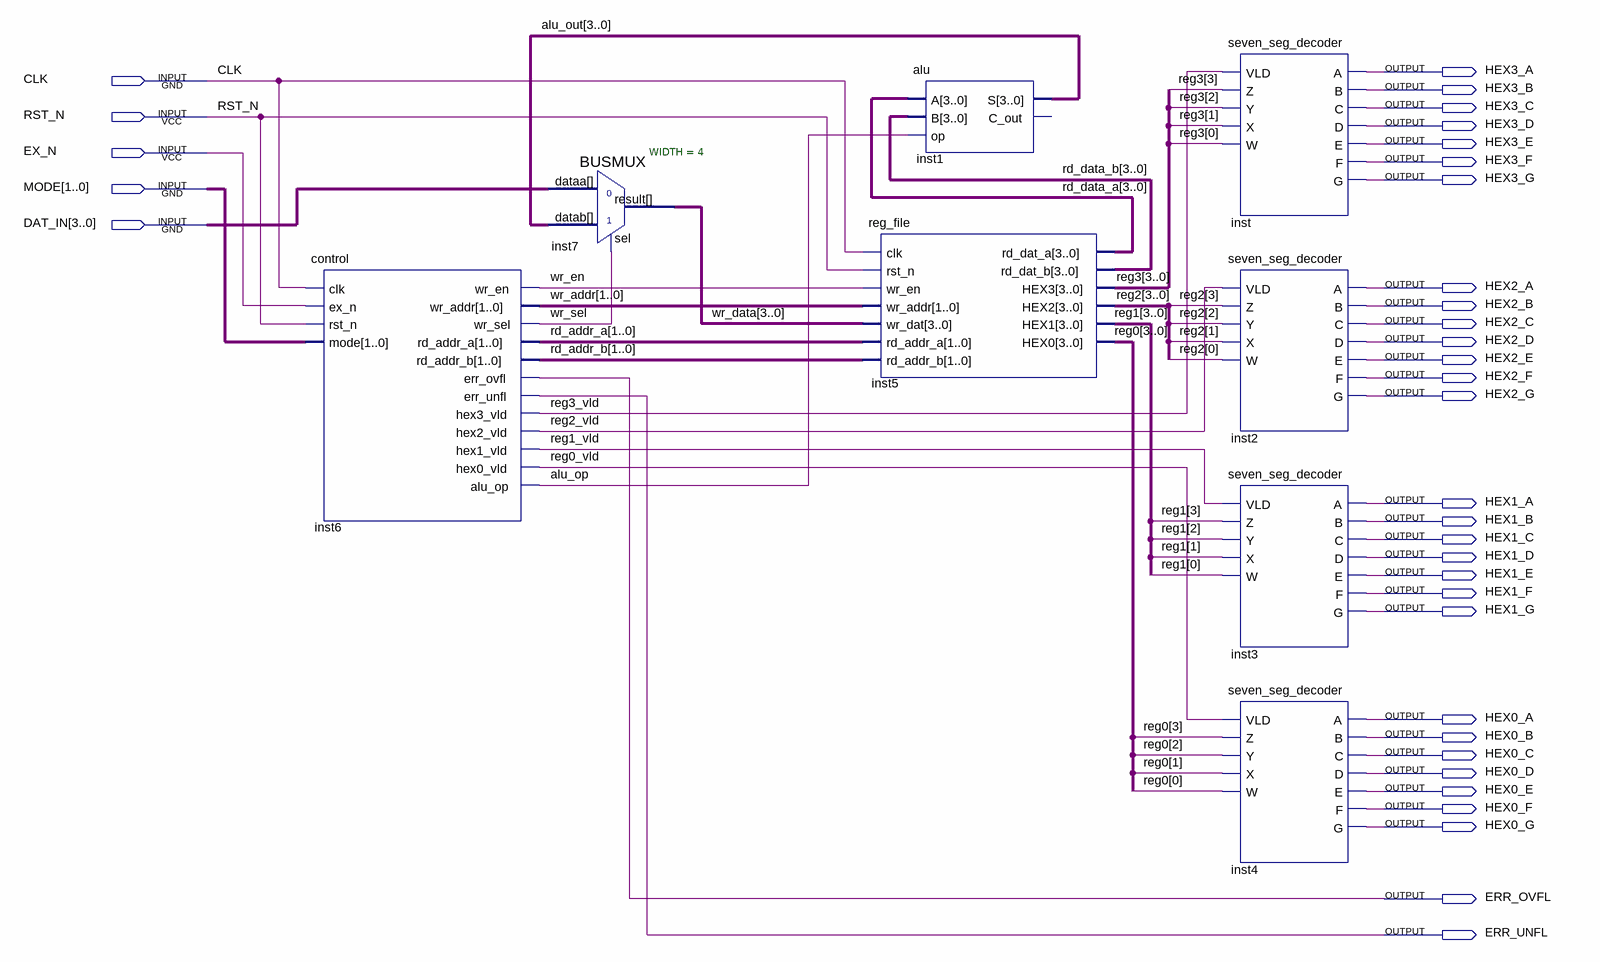
[diagram p0: schematic sheet]
// Quartus schematic final_proj.bdf as structural Verilog: 8 symbols, 35 pins
module final_proj (
  input  CLK,
  input  RST_N,
  input  EX_N,
  input  [1:0] MODE,
  input  [3:0] DAT_IN,
  output HEX3_A,
  output HEX3_B,
  output HEX3_C,
  output HEX3_D,
  output HEX3_E,
  output HEX3_F,
  output HEX3_G,
  output HEX2_A,
  output HEX2_B,
  output HEX2_C,
  output HEX2_D,
  output HEX2_E,
  output HEX2_F,
  output HEX2_G,
  output HEX1_A,
  output HEX1_B,
  output HEX1_C,
  output HEX1_D,
  output HEX1_E,
  output HEX1_F,
  output HEX1_G,
  output HEX0_A,
  output HEX0_B,
  output HEX0_C,
  output HEX0_D,
  output HEX0_E,
  output HEX0_F,
  output HEX0_G,
  output ERR_OVFL,
  output ERR_UNFL
);

  wire alu_op, reg0_vld, reg1_vld, reg2_vld, reg3_vld, wr_en, wr_sel;
  wire [1:0] rd_addr_a, rd_addr_b, wr_addr;
  wire [3:0] alu_out, rd_data_a, rd_data_b, reg0, reg1, reg2, reg3, wr_data;

  control inst6 (
    .clk(CLK), .ex_n(EX_N), .rst_n(RST_N), .mode(MODE), .wr_en(wr_en), .wr_addr(wr_addr), .wr_sel(wr_sel),
    .rd_addr_a(rd_addr_a), .rd_addr_b(rd_addr_b), .err_ovfl(ERR_OVFL), .err_unfl(ERR_UNFL),
    .hex3_vld(reg3_vld), .hex2_vld(reg2_vld), .hex1_vld(reg1_vld), .hex0_vld(reg0_vld), .alu_op(alu_op));
  BUSMUX #(.WIDTH(4)) inst7 (.datab(alu_out), .sel(wr_sel), .dataa(DAT_IN), .result(wr_data));
  reg_file inst5 (
    .clk(CLK), .rst_n(RST_N), .wr_en(wr_en), .wr_addr(wr_addr), .wr_dat(wr_data), .rd_addr_a(rd_addr_a),
    .rd_addr_b(rd_addr_b), .rd_dat_a(rd_data_a), .rd_dat_b(rd_data_b), .HEX3(reg3), .HEX2(reg2), .HEX1(reg1),
    .HEX0(reg0));
  alu inst1 (.A(rd_data_a), .B(rd_data_b), .op(alu_op), .S(alu_out));  // open: C_out
  seven_seg_decoder inst (
    .VLD(reg3_vld), .Z(reg3[3]), .Y(reg3[2]), .X(reg3[1]), .W(reg3[0]), .A(HEX3_A), .B(HEX3_B), .C(HEX3_C),
    .D(HEX3_D), .E(HEX3_E), .F(HEX3_F), .G(HEX3_G));
  seven_seg_decoder inst2 (
    .VLD(reg2_vld), .Z(reg2[3]), .Y(reg2[2]), .X(reg2[1]), .W(reg2[0]), .A(HEX2_A), .B(HEX2_B), .C(HEX2_C),
    .D(HEX2_D), .E(HEX2_E), .F(HEX2_F), .G(HEX2_G));
  seven_seg_decoder inst3 (
    .VLD(reg1_vld), .Z(reg1[3]), .Y(reg1[2]), .X(reg1[1]), .W(reg1[0]), .A(HEX1_A), .B(HEX1_B), .C(HEX1_C),
    .D(HEX1_D), .E(HEX1_E), .F(HEX1_F), .G(HEX1_G));
  seven_seg_decoder inst4 (
    .VLD(reg0_vld), .Z(reg0[3]), .Y(reg0[2]), .X(reg0[1]), .W(reg0[0]), .A(HEX0_A), .B(HEX0_B), .C(HEX0_C),
    .D(HEX0_D), .E(HEX0_E), .F(HEX0_F), .G(HEX0_G));
endmodule
